# Altium project power_inductor_tester.PrjPCB
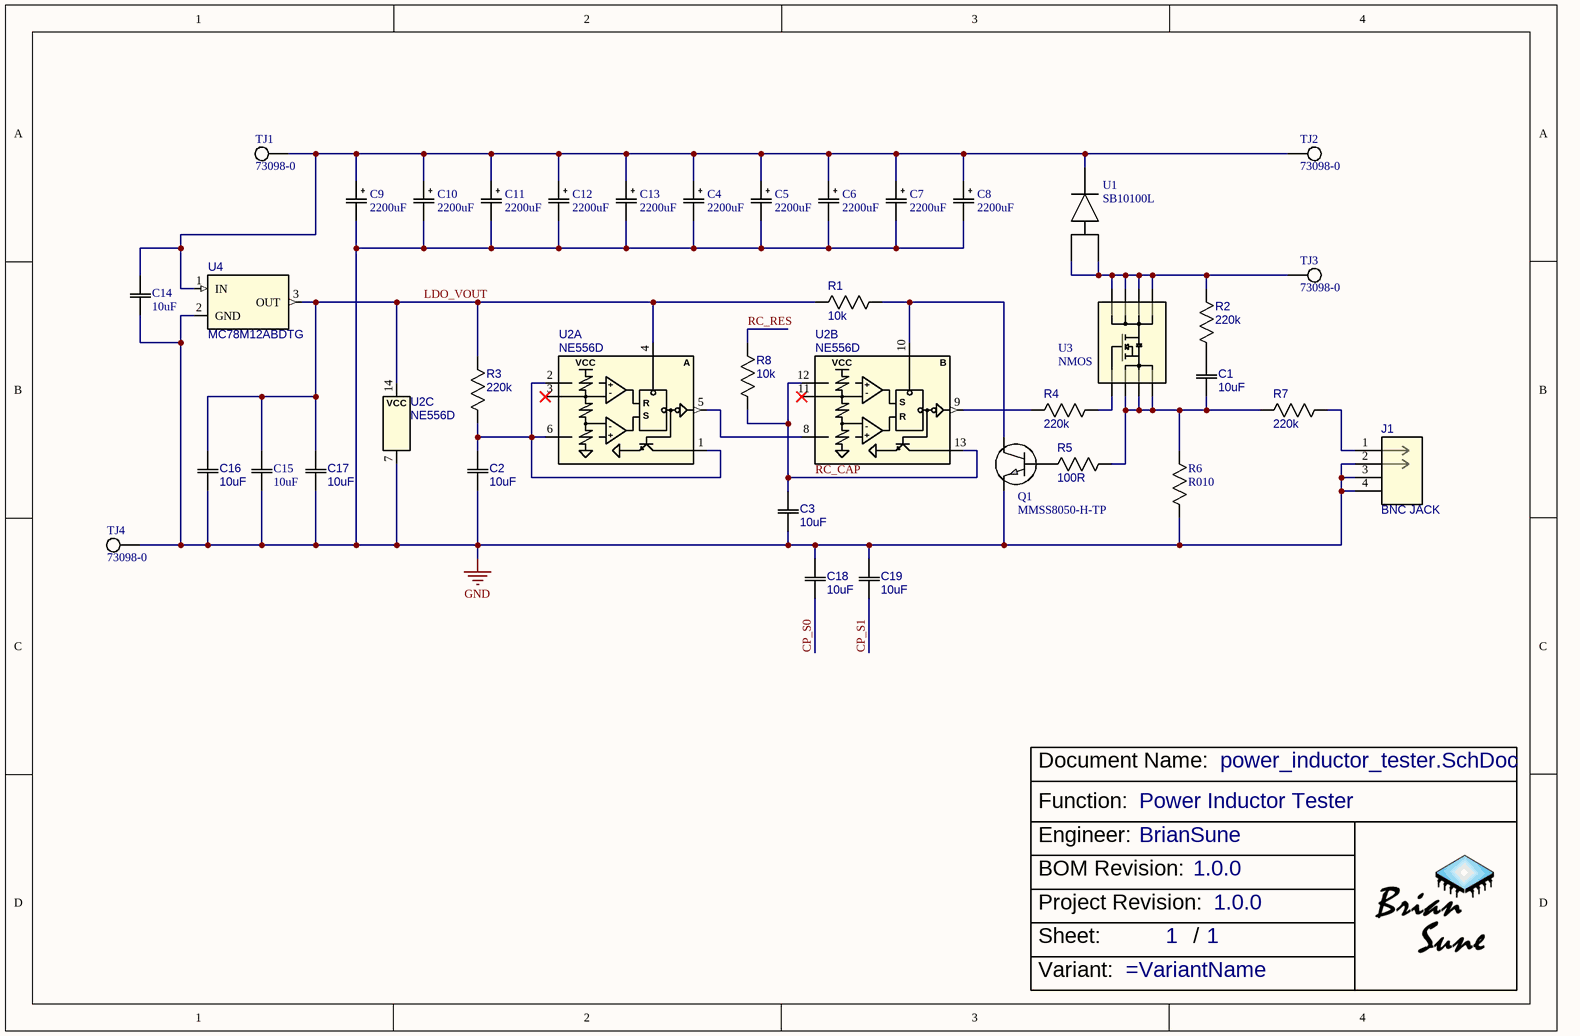
[diagram p0: power_inductor_tester.SchDoc]
ProjectRevision: 1.0.0; BOMRevision: 1.0.0; EngineerName: BrianSune
1 sheet, 38 parts. Net scope: global (net labels, ports and power ports of the same name join across sheets).
Board file: power_inductor_tester.PcbDoc

## Sheet power_inductor_tester.SchDoc
size A4; DocumentNumber: 1; SheetNumber: 1; SheetTotal: 1

### Parts
?  Function: Power Inductor Tester  (hidden comment: TitleBlock)  (graphical)
C1  10uF  [CAP_CC0402_YAG]
C2  10uF  [CAP_CC0402_YAG]
C3  10uF  [CAP_CC0402_YAG]
C4  2200uF  [CAP_2135_18X25_VIS]
C5  2200uF  [CAP_2135_18X25_VIS]
C6  2200uF  [CAP_2135_18X25_VIS]
C7  2200uF  [CAP_2135_18X25_VIS]
C8  2200uF  [CAP_2135_18X25_VIS]
C9  2200uF  [CAP_2135_18X25_VIS]
C10  2200uF  [CAP_2135_18X25_VIS]
C11  2200uF  [CAP_2135_18X25_VIS]
C12  2200uF  [CAP_2135_18X25_VIS]
C13  2200uF  [CAP_2135_18X25_VIS]
C14  10uF  [CAPC220145_145N_KEM]
C15  10uF  [CAPC220145_145N_KEM]
C16  10uF  [CAP_CC0402_YAG]
C17  10uF  [CAP_CC0402_YAG]
C18  10uF  [CAP_CC0402_YAG]
C19  10uF  [CAP_CC0402_YAG]
J1  BNC JACK  [conn2_1-1337543-0_TEC]
Q1  MMSS8050-H-TP  [TNPN_SOT-23_MCC]
R1  10k  [0402_PAN]
R2  220k  [0402_PAN]
R3  220k  [0402_PAN]
R4  220k  [0402_PAN]
R5  100R  [0402_PAN]
R6  R010  [STA_CSSH2728_STP]
R7  220k  [0402_PAN]
R8  10k  [0402_PAN]
TJ1  73098-0  [73098]
TJ2  73098-0  [73098]
TJ3  73098-0  [73098]
TJ4  73098-0  [73098]
U1  SB10100L  [DIO_10100V_ONS]
U2  NE556D  [D14]  (parts A,B,C of 3)
U3  NMOS  [SMT_009LCG-7_DIO]
U4  MC78M12ABDTG  [DPAK-3_ONS]

### Nets
GND: C2.1 C3.1 C4.2 C5.2 C6.2 C7.2 C8.2 C9.2 C10.2 C11.2 C12.2 C13.2 C14.1 C15.1 C16.1 C17.1 C18.2 C19.2 J1.2 J1.3 J1.4 Q1.2 R6.1 TJ4.T1 U2.7(GND) U4.2(GND)
CP_S0: C18.1
CP_S1: C19.1
LDO_VOUT: C15.2 C16.2 C17.2 R1.2 R3.2 U2.4(1RESET) U2.14(VCC) U4.3(OUT)
RC_CAP: C3.2 R8.1 U2.12(2THRES) U2.13(2DISCH)
RC_RES: R8.2
NetC1_1: C1.1 R5.1 R6.2 R7.2 U3.1 U3.2 U3.3
NetC1_2: C1.2 R2.2
NetC2_2: C2.2 R3.1 U2.1(1DISCH) U2.2(1THRES) U2.6(1TRIG)
NetC4_1: C4.1 C5.1 C6.1 C7.1 C8.1 C9.1 C10.1 C11.1 C12.1 C13.1 C14.2 TJ1.T1 TJ2.T1 U1.3(CATHODE) U4.1(IN)
NetJ1_1: J1.1 R7.1
NetQ1_1: Q1.1 R5.2
NetQ1_3: Q1.3 R1.1 U2.10(2RESET)
NetR2_1: R2.1 TJ3.T1 U1.1(ANODE) U1.2(ANODE) U3.5 U3.6 U3.7 U3.8
NetR4_1: R4.1 U2.9(2OUT)
NetR4_2: R4.2 U3.4
NetU2_5: U2.5(1OUT) U2.8(2TRIG)

Not connected (* = marked no-connect by the designer): U2 3(1CONT)* 11(2CONT)*

### Notes on the sheet
- (in symbol MAL214650222E3) +
- (in symbol NE556D, part A) A; +; -; R; S
- (in symbol NE556D, part B) B; +; -; S; R
- (in symbol TitleBlock) Document Name:; Function:; Engineer:; BOM Revision:; Project Revision:; Sheet:; /; Variant:

### Library data of the parts
C1-C3 C16-C19 = C0402C106M9PAC7411: C0402C106M9PAC7411 / Multilayer Ceramic Capacitors MLCC - SMD/SMT 6.3V 10uF X5R 0402 20%; Mfr.: KEMET; ComponentLink1Description: mouser; ComponentLink1URL: https://www.mouser.hk/ProductDetail/KEMET/C0402C106M9PAC7411?qs=sGAEpiMZZMsh%252B1woXyUXj6I3P2ah4Lb%252BTMRMxmSxmgo%3D; Mfr. No: C0402C106M9PAC7411
C4-C13 = MAL214650222E3: Mfr_Name: Vishay; Type: DEV; Copyright: Copyright (C) 2022 Ultra Librarian. All rights reserved.; Manufacturer_Part_Number: MAL214650222E3; RefDes: RefDes
C14 C15 = C0805C106M9RACTU: No Description Available; Mfr_Name: Kemet; Type: DEV; Copyright: Copyright (C) 2022 Ultra Librarian. All rights reserved.; Manufacturer_Part_Number: C0805C106M9RACTU; RefDes: RefDes
J1 = 1-1337543-0: Mfr_Name: TE Connectivity; Manufacturer_Part_Number: 1-1337543-0; ComponentLink1Description: mouser; ComponentLink1URL: https://www.mouser.hk/ProductDetail/TE-Connectivity/5226990-1?qs=6LdcgtkSXnZEvS11ySUywA%3D%3D
Q1 = MMSS8050-H-TP: No Description Available; Mfr_Name: MCC; Type: DEV; Copyright: Copyright (C) 2021 Ultra Librarian. All rights reserved.; Manufacturer_Part_Number: MMSS8050-H-TP; RefDes: RefDes
R1 R8 = RT0402FRE0710KL: RT0402FRE0710KL / SMD 1/16W 10K ohm 1% 50ppm; Mfr.: YAGEO; ComponentLink1Description: mouser; ComponentLink1URL: https://www.mouser.hk/ProductDetail/YAGEO/RT0402FRE0710KL?qs=BXCcY9r%252B08Amup7nMFKW1g%3D%3D; Mfr. No: RT0402FRE0710KL
R2-R4 R7 = RT0402FRE07220KL: RT0402FRE07220KL / Thin Film Resistors - SMD 220K ohm 1% 50ppm High Stability; Mfr.: YAGEO; ComponentLink1Description: mouser; ComponentLink1URL: https://www.mouser.hk/ProductDetail/YAGEO/RT0402FRE07220KL?qs=gY0y7AQI9SMoL0bNFq1hfg%3D%3D; Mfr. No: RT0402FRE07220KL
R5 = RT0402FRE07100RL: RT0402FRE07100RL / Thin Film Resistors - SMD 1/16W 100 ohm 1% 50ppm; Mfr.: YAGEO; ComponentLink1Description: mouser; ComponentLink1URL: https://www.mouser.hk/ProductDetail/YAGEO/RT0402FRE07100RL?qs=BXCcY9r%252B08AcvLZjF7vcwQ%3D%3D; Mfr. No: RT0402FRE07100RL
R6 = CSSH2728FT10L0: Mfr_Name: Stackpole International; Manufacturer_Part_Number: CSSH2728FT30L0
TJ1-TJ4 = 73098-0: Manufacturer: Pomona Electronics; Manufacturer Product Number: 73098-0; Supplier: Description
U1 = SB10100L: SCHOTTKY DIODE TO-277 100V 10A; Mfr_Name: MDD; Manufacturer_Part_Number: SB10100L; RefDes: RefDes; Type: DEV; ComponentLink1Description: digikey; ComponentLink1URL: https://www.digikey.hk/en/products/detail/nextgen-components/SB10100L/15929898?s=N4IgTCBcDaIMoCECMAGVKAyACEBdAvkA
U2 = NE556D: No Description Available; Mfr_Name: Texas Instruments; Copyright: Copyright (C) 2022 Ultra Librarian. All rights reserved.; Manufacturer_Part_Number: NE556D; RefDes: RefDes; Type: DEV
U3 = DMT10H009LCG-7: Mfr_Name: Diodes Inc; Copyright: Copyright (C) 2022 Ultra Librarian. All rights reserved.; Manufacturer_Part_Number: DMT10H009LCG-7; RefDes: RefDes; Type: DEV
U4 = MC78M12ABDTG: No Description Available; Mfr_Name: onsemi; Copyright: Copyright (C) 2022 Ultra Librarian. All rights reserved.; Manufacturer_Part_Number: MC78M12ABDTG; RefDes: RefDes; Type: DEV

## Assembly variants
Default: not fitted TJ1 TJ2 TJ3 TJ4